# EAGLE schematic E4_esquema_base (EAGLE 8.0.1)
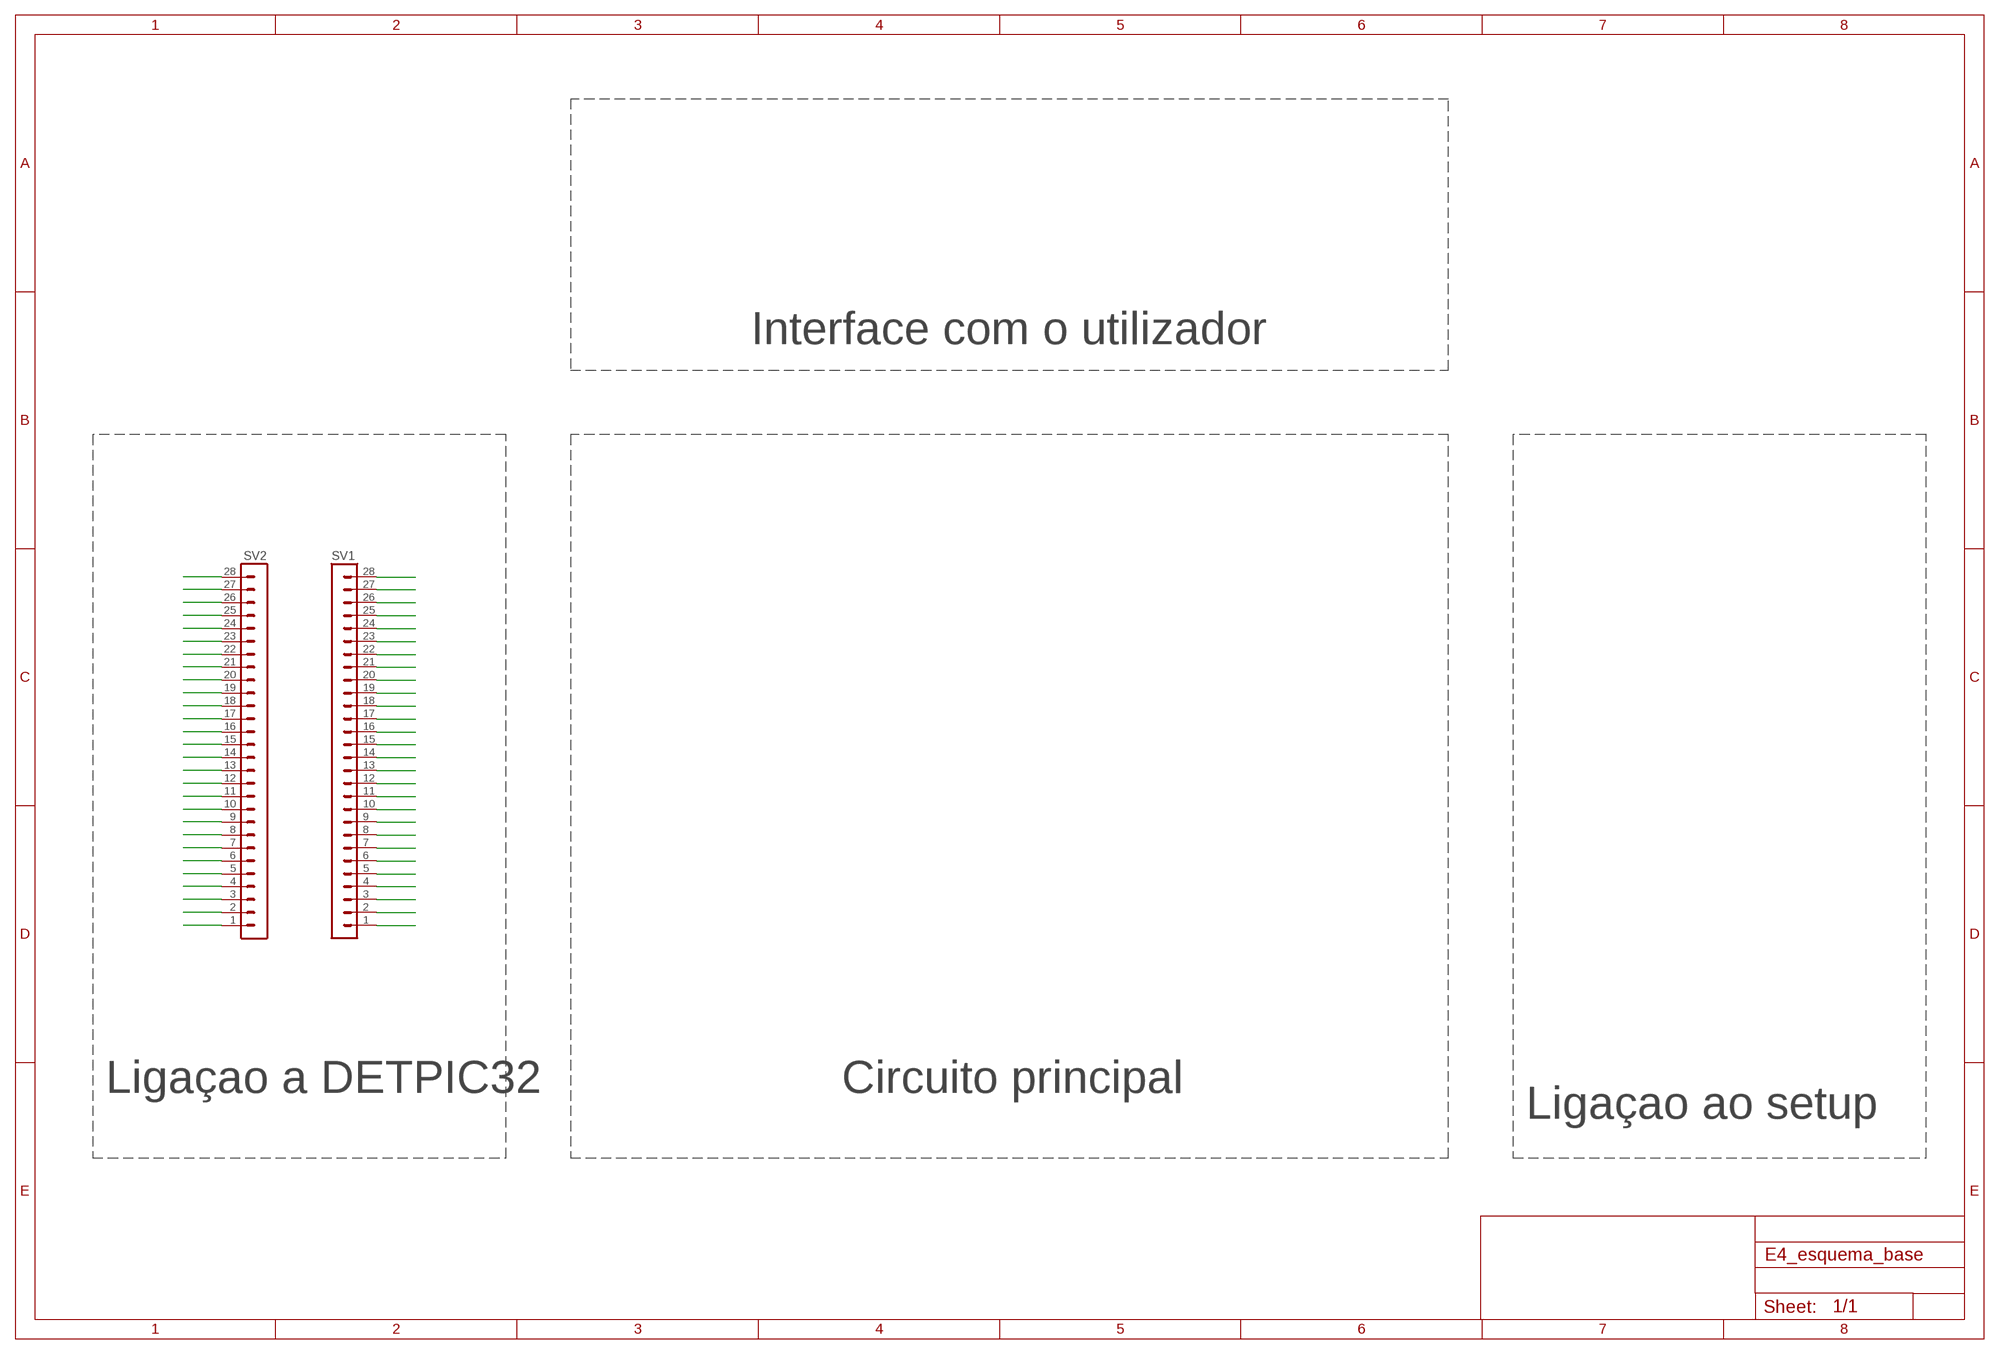
[diagram p0: schematic, sheet 1]

## Parts
SV1  MA28-1L  [MA28-1L]
SV2  MA28-1L  [MA28-1L]

## Nets
N$1: SV1.1
N$2: SV1.2
N$3: SV1.3
N$4: SV1.4
N$5: SV1.5
N$6: SV1.6
N$7: SV1.7
N$8: SV1.8
N$9: SV1.10
N$10: SV1.11
N$11: SV1.12
N$12: SV1.13
N$13: SV1.14
N$14: SV1.15
N$15: SV1.16
N$16: SV1.17
N$17: SV1.18
N$18: SV1.19
N$19: SV1.20
N$20: SV1.21
N$21: SV1.22
N$22: SV1.23
N$23: SV1.24
N$24: SV1.25
N$25: SV1.26
N$26: SV1.27
N$27: SV2.1
N$28: SV2.2
N$29: SV1.28
N$30: SV2.3
N$31: SV2.4
N$32: SV2.5
N$33: SV2.6
N$34: SV2.7
N$35: SV2.8
N$36: SV2.9
N$37: SV2.10
N$38: SV2.11
N$39: SV2.12
N$40: SV2.13
N$41: SV2.14
N$42: SV2.15
N$43: SV2.16
N$44: SV2.17
N$45: SV2.18
N$46: SV2.19
N$47: SV2.20
N$48: SV2.21
N$49: SV2.22
N$50: SV2.23
N$51: SV2.24
N$52: SV2.25
N$53: SV2.26
N$54: SV2.27
N$55: SV2.28
NET: SV1.9

## Notes on the sheet
- Interface com o utilizador
- Ligaçao a DETPIC32 | Circuito principal
- Ligaçao ao setup

## Library data of the parts
SV1 SV2 = e4:MA28-1L: PIN HEADER; OC_FARNELL: unknown; OC_NEWARK: unknown